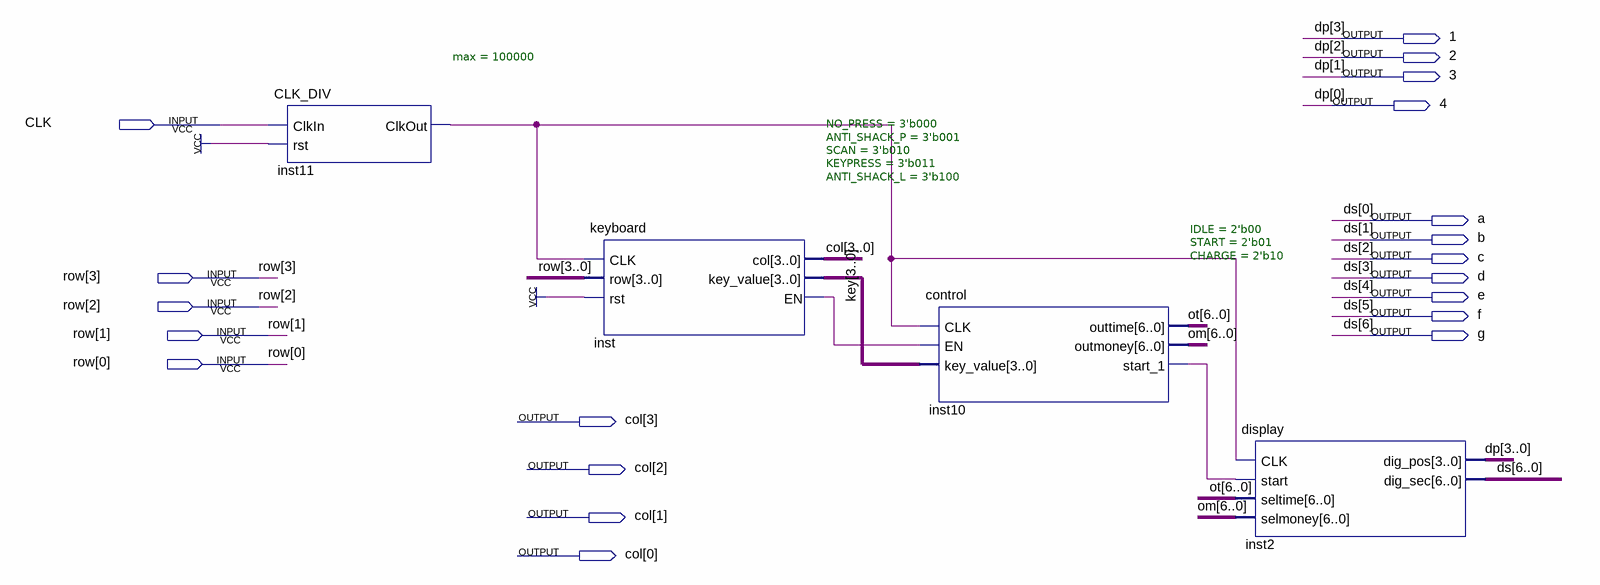
[diagram p0: schematic sheet]
// Quartus schematic Top.bdf as structural Verilog: 4 symbols, 20 pins
module Top (
  input  CLK,
  input  [3:0] row,
  output \1 ,
  output \2 ,
  output \3 ,
  output \4 ,
  output a,
  output b,
  output c,
  output d,
  output e,
  output f,
  output g,
  output [3:0] col
);

  wire inst10_start_1, inst11_clkout, inst_en;
  wire [3:0] key;
  wire [6:0] om, ot;

  CLK_DIV #(.max(100000)) inst11 (.ClkIn(CLK), .rst(1'b1), .ClkOut(inst11_clkout));
  keyboard #(.NO_PRESS(3'b000), .ANTI_SHACK_P(3'b001), .SCAN(3'b010), .KEYPRESS(3'b011), .ANTI_SHACK_L(3'b100)) inst (
    .CLK(inst11_clkout), .row(row), .rst(1'b1), .col(col), .key_value(key), .EN(inst_en));
  control #(.IDLE(2'b00), .START(2'b01), .CHARGE(2'b10)) inst10 (
    .CLK(inst11_clkout), .EN(inst_en), .key_value(key), .outtime(ot), .outmoney(om), .start_1(inst10_start_1));
  display inst2 (
    .CLK(inst11_clkout), .start(inst10_start_1), .seltime(ot), .selmoney(om), .dig_pos({\1 , \2 , \3 , \4 }),
    .dig_sec({g, f, e, d, c, b, a}));

  // Other names for the same wires on the sheet: dp[3:0] = {\1 , \2 , \3 , \4 }; ds[6:0] = {g, f, e, d, c, b, a}
endmodule
